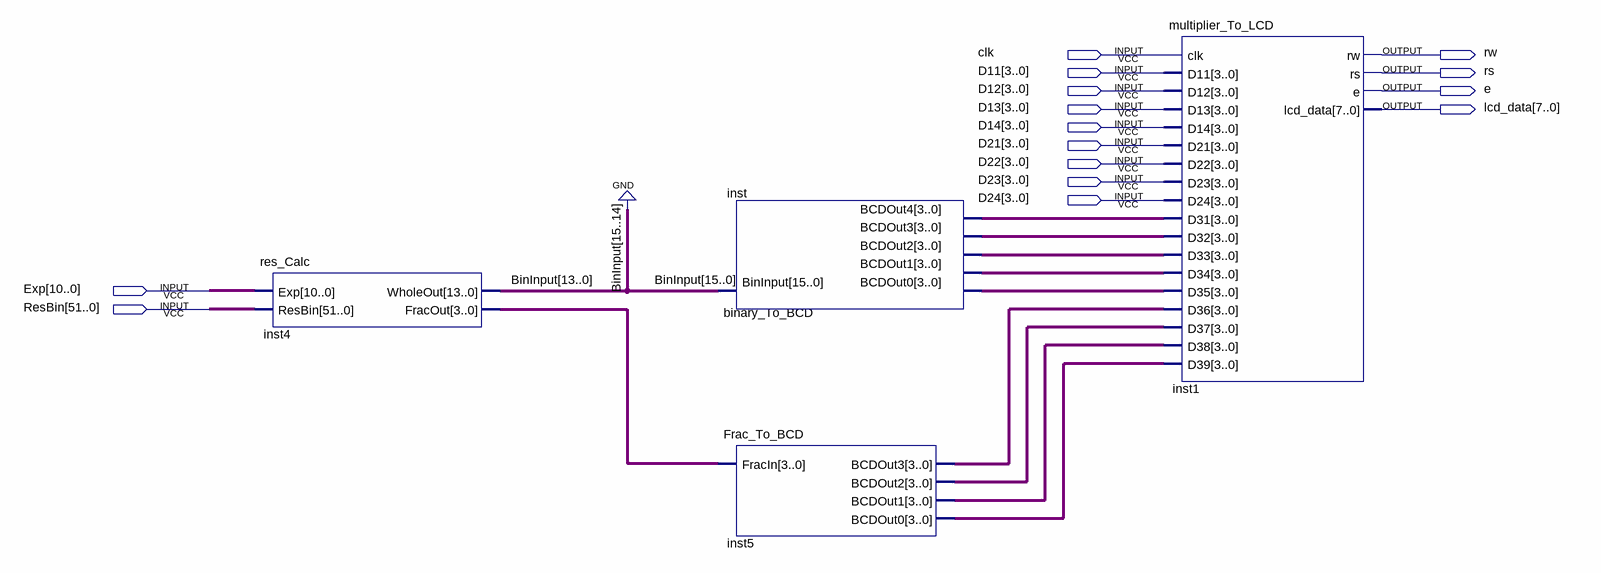
[diagram p0: schematic sheet]
// Quartus schematic Output.bdf as structural Verilog: 4 symbols, 15 pins
module Output (
  input  clk,
  input  [3:0] D11,
  input  [3:0] D12,
  input  [3:0] D13,
  input  [3:0] D14,
  input  [3:0] D21,
  input  [3:0] D22,
  input  [3:0] D23,
  input  [3:0] D24,
  input  [10:0] Exp,
  input  [51:0] ResBin,
  output rw,
  output rs,
  output e,
  output [7:0] lcd_data
);

  wire [3:0] inst4_fracout, inst5_bcdout0, inst5_bcdout1, inst5_bcdout2, inst5_bcdout3, inst_bcdout0,
       inst_bcdout1, inst_bcdout2, inst_bcdout3, inst_bcdout4;
  wire [13:0] BinInput;

  res_Calc inst4 (.Exp(Exp), .ResBin(ResBin), .WholeOut(BinInput), .FracOut(inst4_fracout));
  binary_To_BCD inst (
    .BinInput({2'b00, BinInput}), .BCDOut0(inst_bcdout0), .BCDOut1(inst_bcdout1), .BCDOut2(inst_bcdout2),
    .BCDOut3(inst_bcdout3), .BCDOut4(inst_bcdout4));
  Frac_To_BCD inst5 (
    .FracIn(inst4_fracout), .BCDOut3(inst5_bcdout3), .BCDOut2(inst5_bcdout2), .BCDOut1(inst5_bcdout1),
    .BCDOut0(inst5_bcdout0));
  multiplier_To_LCD inst1 (
    .clk(clk), .D11(D11), .D12(D12), .D13(D13), .D14(D14), .D21(D21), .D22(D22), .D23(D23), .D24(D24),
    .D31(inst_bcdout4), .D32(inst_bcdout3), .D33(inst_bcdout2), .D34(inst_bcdout1), .D35(inst_bcdout0),
    .D36(inst5_bcdout3), .D37(inst5_bcdout2), .D38(inst5_bcdout1), .D39(inst5_bcdout0), .rw(rw), .rs(rs),
    .e(e), .lcd_data(lcd_data));
endmodule
